# EAGLE design BatteryBalancer (EAGLE 9.1.3)
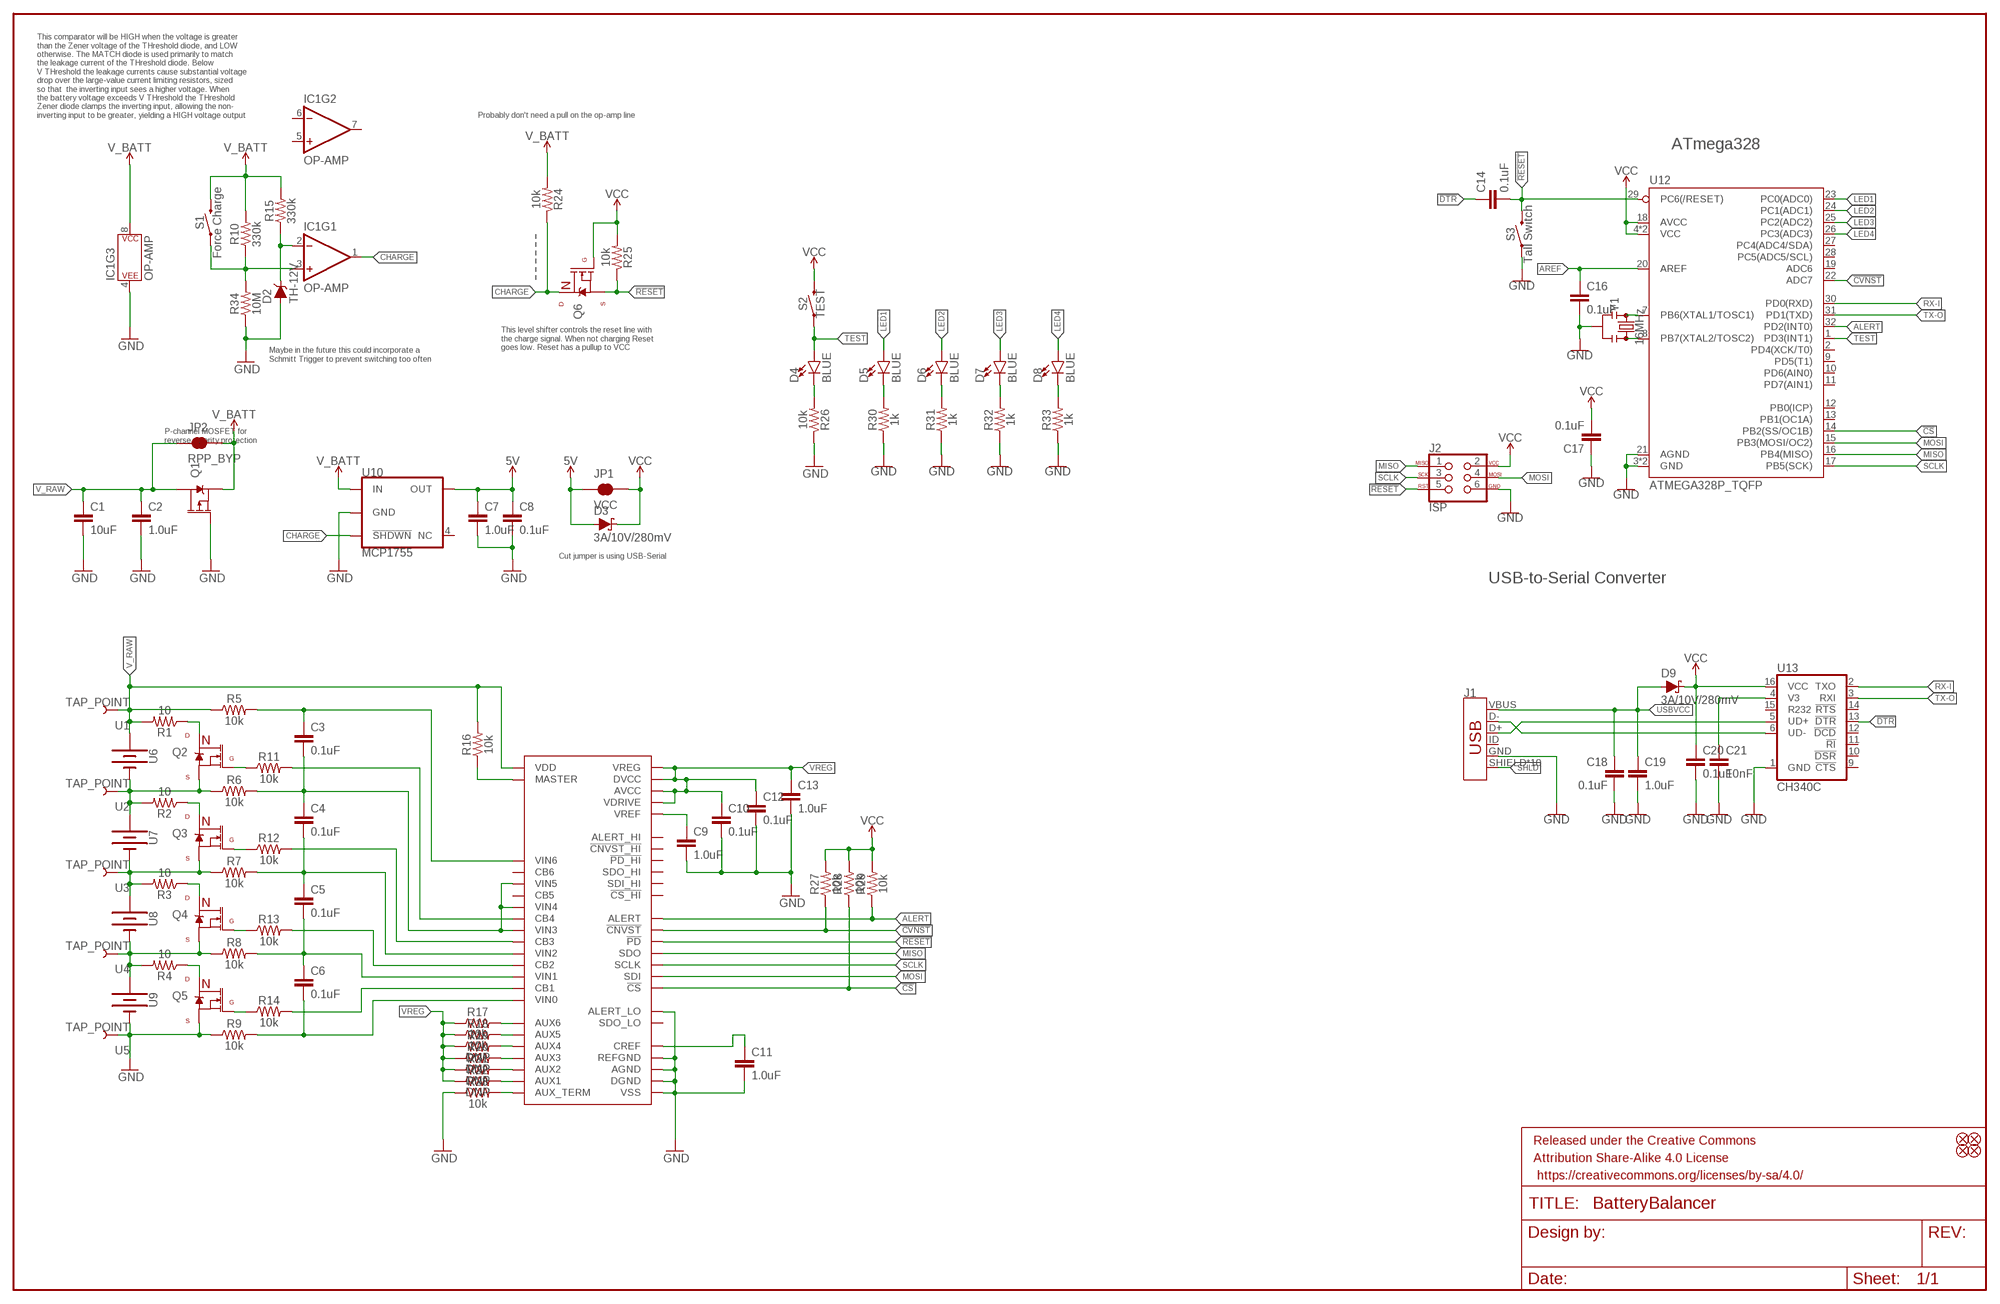
[diagram p0: schematic, sheet 1]

## Parts
C1  10uF  10UF-1210-50V-20%  [1210]
C2  1.0uF  1.0UF-1206-50V-10%  [1206]
C3  0.1uF  0.1UF-0603-25V-5%  [0603]
C4  0.1uF  0.1UF-0603-25V-5%  [0603]
C5  0.1uF  0.1UF-0603-25V-5%  [0603]
C6  0.1uF  0.1UF-0603-25V-5%  [0603]
C7  1.0uF  1.0UF-0603-16V-10%-X7R  [0603]
C8  0.1uF  0.1UF-0603-25V-5%  [0603]
C9  1.0uF  1.0UF-0603-16V-10%-X7R  [0603]
C10  0.1uF  0.1UF-0603-25V-5%  [0603]
C11  1.0uF  1.0UF-0603-16V-10%-X7R  [0603]
C12  0.1uF  0.1UF-0603-25V-5%  [0603]
C13  1.0uF  1.0UF-0603-16V-10%-X7R  [0603]
C14  0.1uF  0.1UF-0603-25V-(+80/-20%)  [0603]
C16  0.1uF  0.1UF-0603-25V-(+80/-20%)  [0603]
C17  0.1uF  0.1UF-0603-25V-(+80/-20%)  [0603]
C18  0.1uF  0.1UF-0603-25V-(+80/-20%)  [0603]
C19  1.0uF  1.0UF-0603-16V-10%-X7R  [0603]
C20  0.1uF  0.1UF-0603-25V-(+80/-20%)  [0603]
C21  10nF  10NF-0603-50V-10%  [0603]
D2  TH-12V  DIODE-ZENER-MMBZ5233BLT1G  [SOT23-3]
D3  3A/10V/280mV  DIODE-SCHOTTKY-BAT60A  [SOD-323]
D4  BLUE  LED-BLUE0603  [LED-0603]
D5  BLUE  LED-BLUE0603  [LED-0603]
D6  BLUE  LED-BLUE0603  [LED-0603]
D7  BLUE  LED-BLUE0603  [LED-0603]
D8  BLUE  LED-BLUE0603  [LED-0603]
D9  3A/10V/280mV  DIODE-SCHOTTKY-BAT60A  [SOD-323]
FD1  FIDUCIALUFIDUCIAL  [FIDUCIAL-MICRO]
FD2  FIDUCIALUFIDUCIAL  [FIDUCIAL-MICRO]
FD3  FIDUCIALUFIDUCIAL  [FIDUCIAL-MICRO]
FD4  FIDUCIALUFIDUCIAL  [FIDUCIAL-MICRO]
FRAME1  FRAME-LEDGER  [CREATIVE_COMMONS]
IC1  OP-AMP  OPAMP-DUALU  [SO08]
J1  USB_MICRO-B_HALF_PTH_MILL  [USB-MICROB-PTH-MILL]
J2  ISP  AVR_SPI_PROG_3X2TESTPOINTS  [2X3_TEST_POINTS]
JP1  VCC  JUMPER-SMT_2_NC_TRACE_SILK  [SMT-JUMPER_2_NC_TRACE_SILK]
JP2  RPP_BYP  JUMPER-SMT_2_NC_TRACE_SILK  [SMT-JUMPER_2_NC_TRACE_SILK]
Q1  MOSFET_PCH-IRLML2244  [SOT23-3]
Q2  AMP_MOSFET_NCH-2N7002K  [SOT23-3]
Q3  AMP_MOSFET_NCH-2N7002K  [SOT23-3]
Q4  AMP_MOSFET_NCH-2N7002K  [SOT23-3]
Q5  AMP_MOSFET_NCH-2N7002K  [SOT23-3]
Q6  AMP_MOSFET_NCH-2N7002K  [SOT23-3]
R1  10  10OHM-1206-1/4W-1%  [1206]
R2  10  10OHM-1206-1/4W-1%  [1206]
R3  10  10OHM-1206-1/4W-1%  [1206]
R4  10  10OHM-1206-1/4W-1%  [1206]
R5  10k  10KOHM-0603-1/10W-1%  [0603]
R6  10k  10KOHM-0603-1/10W-1%  [0603]
R7  10k  10KOHM-0603-1/10W-1%  [0603]
R8  10k  10KOHM-0603-1/10W-1%  [0603]
R9  10k  10KOHM-0603-1/10W-1%  [0603]
R10  330k  330KOHM-0603-1/10W-1%  [0603]
R11  10k  10KOHM-0603-1/10W-1%  [0603]
R12  10k  10KOHM-0603-1/10W-1%  [0603]
R13  10k  10KOHM-0603-1/10W-1%  [0603]
R14  10k  10KOHM-0603-1/10W-1%  [0603]
R15  330k  330KOHM-0603-1/10W-1%  [0603]
R16  10k  10KOHM-0603-1/10W-1%  [0603]
R17  10k  10KOHM-0603-1/10W-1%  [0603]
R18  10k  10KOHM-0603-1/10W-1%  [0603]
R19  DNP  NTC_STOP_ONE_SIDE  [AXIAL-0.3]
R20  DNP  NTC_STOP_ONE_SIDE  [AXIAL-0.3]
R21  DNP  NTC_STOP_ONE_SIDE  [AXIAL-0.3]
R22  DNP  NTC_STOP_ONE_SIDE  [AXIAL-0.3]
R23  10k  10KOHM-0603-1/10W-1%  [0603]
R24  10k  10KOHM-0603-1/10W-1%  [0603]
R25  10k  10KOHM-0603-1/10W-1%  [0603]
R26  10k  10KOHM-0603-1/10W-1%  [0603]
R27  10k  10KOHM-0603-1/10W-1%  [0603]
R28  10k  10KOHM-0603-1/10W-1%  [0603]
R29  10k  10KOHM-0603-1/10W-1%  [0603]
R30  1k  1KOHM-0603-1/10W-1%  [0603]
R31  1k  1KOHM-0603-1/10W-1%  [0603]
R32  1k  1KOHM-0603-1/10W-1%  [0603]
R33  1k  1KOHM-0603-1/10W-1%  [0603]
R34  10M  10MOHM-0603-1/10W-5%  [0603]
S1  Force Charge  MOMENTARY-SWITCH-SPST-SMD-5.2-TALL-REDUNDANT  [TACTILE_SWITCH_SMD_5.2MM]
S2  TEST  MOMENTARY-SWITCH-SPST-SMD-5.2-TALL-REDUNDANT  [TACTILE_SWITCH_SMD_5.2MM]
S3  Tall Switch  MOMENTARY-SWITCH-SPST-SMD-5.2-TALL-REDUNDANT  [TACTILE_SWITCH_SMD_5.2MM]
U1  TAP_POINT  [1X01_SMD_0.1IN]
U2  TAP_POINT  [1X01_SMD_0.1IN]
U3  TAP_POINT  [1X01_SMD_0.1IN]
U4  TAP_POINT  [1X01_SMD_0.1IN]
U5  TAP_POINT  [1X01_SMD_0.1IN]
U6  SINGLECELL  (no package)
U7  SINGLECELL  (no package)
U8  SINGLECELL  (no package)
U9  SINGLECELL  (no package)
U10  MCP1755  [SOT23-5]
U11  AD7280A  [LQFP-48]
U12  ATMEGA328P_TQFP  [TQFP32-08]
U13  CH340C  [SO016]
Y1  16MHz  RESONATOR-16MHZSMD_3.2X1.3  [RESONATOR-SMD-3.2X1.3]

## Nets
5V: C7.1 C8.1 D3.A JP1.1 U10.5(OUT)
!CS: R28.1 U11.21(!CS) U12.14(PB2(SS/OC1B))
!CVNST: R27.1 U11.24(!CNVST) U12.22(ADC7)
!DTR: C14.1 U13.13(!DTR)
!RESET: C14.2 J2.5 Q6.2(S) R25.1 S3.3 S3.4 U11.15(!PD) U12.29(PC6(/RESET))
ALERT: R29.1 U11.27(ALERT) U12.32(PD2(INT0))
AREF: C16.1 U12.20(AREF)
CHARGE: IC1.1(OUT) Q6.3(D) R24.1 U10.3(!SHDWN)
D+: J1.D+ U13.5(UD+)
D-: J1.D- U13.6(UD-)
GND: C1.2 C2.2 C7.2 C8.2 C9.2 C10.2 C11.2 C12.2 C13.2 C16.2 C17.1 C18.2 C19.2 C20.2 C21.2 D2.1(A) IC1.4(P$V-) J1.GND J2.6 Q1.1(G) Q5.2(S) R9.1 R23.1 R26.1 R30.1 R31.1 R32.1 R33.1 R34.1 S3.1 S3.2 U5.1 U9.- U10.2(GND) U11.17(VSS) U11.20(DGND) U11.28(ALERT_LO) U11.31(AGND) U11.41(REFGND) U12.3(GND) U12.5(GND) U12.21(AGND) U13.1(GND) Y1.2
LED1: D5.A U12.23(PC0(ADC0))
LED2: D6.A U12.24(PC1(ADC1))
LED3: D7.A U12.25(PC2(ADC2))
LED4: D8.A U12.26(PC3(ADC3))
MISO: J2.1 U11.26(SDO) U12.16(PB4(MISO))
MOSI: J2.4 U11.23(SDI) U12.15(PB3(MOSI/OC2))
N$3: U12.7(PB6(XTAL1/TOSC1)) Y1.1
N$4: U12.8(PB7(XTAL2/TOSC2)) Y1.3
N$5: Q2.3(D) R1.1
N$6: Q2.2(S) R2.2 R6.1 U2.1 U6.- U7.+
N$7: Q3.3(D) R2.1
N$8: Q3.2(S) R3.2 R7.1 U3.1 U7.- U8.+
N$9: Q4.3(D) R3.1
N$10: Q4.2(S) R4.2 R8.1 U4.1 U8.- U9.+
N$11: Q5.3(D) R4.1
N$12: Q2.1(G) R11.1
N$13: Q3.1(G) R12.1
N$14: R16.1 U11.14(MASTER)
N$15: Q4.1(G) R13.1
N$16: Q5.1(G) R14.1
N$17: C6.2 R9.2 U11.13(VIN0)
N$18: R14.2 U11.12(CB1)
N$19: C5.2 C6.1 R8.2 U11.11(VIN1)
N$20: R13.2 U11.10(CB2)
N$21: C4.2 C5.1 R7.2 U11.9(VIN2)
N$22: R12.2 U11.8(CB3)
N$23: R22.P$2 U11.38(AUX1)
N$24: R11.2 U11.6(CB4)
N$25: C3.1 R5.2 U11.1(VIN6)
N$26: C3.2 C4.1 R6.2 U11.3(VIN5) U11.5(VIN4) U11.7(VIN3)
N$27: C9.1 U11.40(VREF)
N$28: R17.2 U11.33(AUX6)
N$29: C11.1 U11.39(CREF)
N$30: R23.2 U11.32(AUX_TERM)
N$31: R18.2 U11.34(AUX5)
N$32: R21.P$2 U11.37(AUX2)
N$33: R20.P$2 U11.36(AUX3)
N$34: R19.P$2 U11.35(AUX4)
N$37: D4.C R26.2
N$38: C21.1 U13.4(V3)
N$39: D8.C R33.2
N$40: IC1.3(+IN) R10.1 R34.2 S1.1 S1.2
N$41: D2.3(C) IC1.2(-IN) R15.1
N$42: D7.C R32.2
N$43: D6.C R31.2
N$44: D5.C R30.2
RX-I: U12.30(PD0(RXD)) U13.2(TXO)
SCLK: J2.3 U11.22(SCLK) U12.17(PB5(SCK))
SHLD: J1.SHIELD J1.SHIELD2(SHIELD) J1.SHIELD3(SHIELD) J1.SHIELD4(SHIELD) J1.SHIELD5(SHIELD) J1.SHIELD6(SHIELD) J1.SHIELD7(SHIELD) J1.SHIELD8(SHIELD) J1.SHIELD9(SHIELD) J1.SHIELD10(SHIELD)
TEST: D4.A S2.1 S2.2 U12.1(PD3(INT1))
TX-O: U12.31(PD1(TXD)) U13.3(RXI)
USBVCC: C18.1 C19.1 D9.A J1.VBUS
V_BATT: IC1.8(P$V+) JP2.2 Q1.2(S) R10.2 R15.2 R24.2 S1.3 S1.4 U10.1(IN)
V_RAW: C1.1 C2.1 JP2.1 Q1.3(D) R1.2 R5.1 R16.2 U1.1 U6.+ U11.16(VDD)
VCC: C17.2 C20.1 D3.C D9.C J2.2 JP1.2 Q6.1(G) R25.2 R27.2 R28.2 R29.2 S2.3 S2.4 U12.4(VCC) U12.6(VCC) U12.18(AVCC) U13.16(VCC)
VREG: C10.1 C12.1 C13.1 R17.1 R18.1 R19.P$1 R20.P$1 R21.P$1 R22.P$1 U11.18(VREG) U11.19(DVCC) U11.29(VDRIVE) U11.30(AVCC)
Unconnected: IC1.5(+IN) IC1.6(-IN) IC1.7(OUT) J1.ID U10.4(NC) U11.2(CB6) U11.4(CB5) U11.25(SDO_LO) U11.42(ALERT_HI) U11.43(SDI_HI) U11.44(!CNVST_HI) U11.45(SDO_HI) U11.46(!CS_HI) U11.47(!PD_HI) U12.2(PD4(XCK/T0)) U12.9(PD5(T1)) U12.10(PD6(AIN0)) U12.11(PD7(AIN1)) U12.12(PB0(ICP)) U12.13(PB1(OC1A)) U12.19(ADC6) U12.27(PC4(ADC4/SDA)) U12.28(PC5(ADC5/SCL)) U13.9(!CTS) U13.10(!DSR) U13.11(!RI) U13.12(!DCD) U13.14(!RTS) U13.15(R232)

## Notes on the sheet
- This comparator will be HIGH when the voltage is greater
  than the Zener voltage of the THreshold diode, and LOW 
  otherwise. The MATCH diode is used primarily to match
  the leakage current of the THreshold diode. Below 
  V THreshold the leakage currents cause substantial voltage 
  drop over the large-value current limiting resistors, sized 
  so that  the inverting input sees a higher voltage. When 
  the battery voltage exceeds V THreshold the THreshold
  Zener diode clamps the inverting input, allowing the non-
  inverting input to be greater, yielding a HIGH voltage output
- Probably don't need a pull on the op-amp line
- ATmega328
- This level shifter controls the reset line with
  the charge signal. When not charging Reset
  goes low. Reset has a pullup to VCC
- Maybe in the future this could incorporate a 
  Schmitt Trigger to prevent switching too often
- P-channel MOSFET for 
  reverse polarity protection
- Cut jumper is using USB-Serial
- USB-to-Serial Converter

## Library data of the parts
C1 = SparkFun-Capacitors:10UF: 10.0µF ceramic capacitors A capacitor is a passive two-terminal electrical component used to store electrical energy temporarily in an electric field.; PROD_ID: CAP-09824
C2 = SparkFun-Capacitors:1.0UF: 1µF ceramic capacitors A capacitor is a passive two-terminal electrical component used to store electrical energy temporarily in an electric field.; PROD_ID: CAP-09822
C3-C6 C8 C10 C12 = SparkFun-Capacitors:0.1UF: 0.1µF ceramic capacitors A capacitor is a passive two-terminal electrical component used to store electrical energy temporarily in an electric field.; PROD_ID: CAP-08604
C7 C9 C11 C13 C19 = SparkFun-Capacitors:1.0UF: 1µF ceramic capacitors A capacitor is a passive two-terminal electrical component used to store electrical energy temporarily in an electric field.; PROD_ID: CAP-13930
C14 C16-C18 C20 = SparkFun-Capacitors:0.1UF: 0.1µF ceramic capacitors A capacitor is a passive two-terminal electrical component used to store electrical energy temporarily in an electric field.; PROD_ID: CAP-00810
C21 = SparkFun-Capacitors:10NF: 0.01uF/10nF/10,000pF ceramic capacitors A capacitor is a passive two-terminal electrical component used to store electrical energy temporarily in an electric field. CAP-09321; PROD_ID: CAP-00867
D2 = SparkFun-DiscreteSemi:DIODE-ZENER: Zener Diode A Zener diode allows current to flow from its anode to its cathode like a normal semiconductor diode, but it also permits current to flow in the reverse direction when its "Zener voltage" is reached. - WIkipedia; PROD_ID: DIO-14123; VALUE: 6V
D3 D9 = SparkFun-DiscreteSemi:DIODE-SCHOTTKY: Schottky diode A Schottky diode is a semiconductor diode which has a low forward voltage drop and a very fast switching action.; PROD_ID: DIO-14072
D4-D8 = SparkFun-LED:LED-BLUE: Blue SMD LED Used in manufacturing of various products at SparkFun Packages: 0603 - SMD 0603 package [Product Link] <http://www.digikey.com/product-detail/en/SMLE12BC7TT86/511-1589-2-ND/1641808> 1206 - SMD1206 package [Product Link] <http://www.digikey.com/product-detail/en/lite-on-inc/LTST-C150TBKT/160-1643-1-ND/573584> SparkFun Products: ESP8266 Thing-Dev Board <https://www.sparkfun.com/products/13711> RedBoard <https://www.sparkfun.com/products/12757>; PROD_ID: DIO-08575
FD1-FD4 = SparkFun-Aesthetics:FIDUCIAL: Fiducial Alignment Points Point-of-reference for pick-and-place machines and other optical instruments.
FRAME1 = SparkFun-Aesthetics:FRAME-LEDGER: Schematic Frame - Ledger Standard 11x14 US Ledger frame
IC1 = SparkFun-IC-Amplifiers:OPAMP-DUAL: Generic op-amp footprint This component is for the standard 358 pinning of a dual op-amp From the LM358 datasheet: Pin 1: Output A Pin 2: Inverting Input A Pin 3: Non-Inverting Input A Pin 4: Gnd Pin 5: Non-Inverting Input B Pin 6: Inverting Input B Pin 7: Output B Pin 8: V+; PROD_ID: NA-XXXXX
J1 = SparkFun-Connectors:USB_MICRO-B: USB Type Micro-B Connector Male/female and PTH/SMT variants SparkFun Products: SparkFun microB USB Breakout <https://www.sparkfun.com/products/12035> SparkFun USB microB Plug Breakout <https://www.sparkfun.com/products/10031> SparkFun ESP8266 Thing <https://www.sparkfun.com/products/13231>; PROD_ID: CONN-13711
J2 = SparkFun-Connectors:AVR_SPI_PROG_3X2: AVR ISP 6 Pin This is the reduced ISP connector for AVR programming. Common on Arduino. This footprint will take up less PCB space and can be used with a 10-pin to 6-pin adapter such as SKU: BOB-08508 **Special note about "TEST_POINT" package. The stop mask is on the top side, so if you want your programming test points to be on the bottom of your board, make sure to place this package on the bottom side of the board. This also ensure that the orientation to program from the bottom side will be correct. SparkFun Products: SparkFun ISP Pogo Adapter <https://www.sparkfun.com/products/11591> - NS Tiny AVR Programmer <https://www.sparkfun.com/products/11801> -PTH
JP1 JP2 = SparkFun-Jumpers:JUMPER-SMT_2_NC_TRACE: Normally closed trace jumper This jumper has a trace between two pads so it's normally closed (NC). Use a razor knife to open the connection. For best results follow the IPC guidelines for cutting traces: Cutout at least 0.063 mm (0.005 in). Remove all loose material to clean up the cut area. Seal the cut with an approved epoxy. Reapply solder to reclose the connection.
Q1 = SparkFun-DiscreteSemi:MOSFET_PCH: P-channel MOSFETs Voltage controlled devices that allow control of high current outputs. SparkFun Products: SparkFun ESP32 Thing <https://www.sparkfun.com/products/13907> SparkFun ESP8266 Thing <https://www.sparkfun.com/products/13231>; PROD_ID: TRANS-11153; VALUE: 4.3A/20V/54mΩ
Q2-Q6 = MTAES_V2_UniqueParts:AMP_MOSFET_NCH
R1-R4 = SparkFun-Resistors:10OHM: 10Ω resistor A resistor is a passive two-terminal electrical component that implements electrical resistance as a circuit element. Resistors act to reduce current flow, and, at the same time, act to lower voltage levels within circuits. - Wikipedia; PROD_ID: RES-08705
R5-R9 R11-R14 R16-R18 R23-R29 = SparkFun-Resistors:10KOHM: 10kΩ resistor A resistor is a passive two-terminal electrical component that implements electrical resistance as a circuit element. Resistors act to reduce current flow, and, at the same time, act to lower voltage levels within circuits. - Wikipedia; PROD_ID: RES-00824
R10 R15 = SparkFun-Resistors:330KOHM: 330kΩ resistor A resistor is a passive two-terminal electrical component that implements electrical resistance as a circuit element. Resistors act to reduce current flow, and, at the same time, act to lower voltage levels within circuits. - Wikipedia; PROD_ID: RES-08968
R19-R22 = BBLib:NTC_STOP_ONE_SIDE
R30-R33 = SparkFun-Resistors:1KOHM: 1kΩ resistor A resistor is a passive two-terminal electrical component that implements electrical resistance as a circuit element. Resistors act to reduce current flow, and, at the same time, act to lower voltage levels within circuits. - Wikipedia; PROD_ID: RES-07856
R34 = SparkFun-Resistors:10MOHM: RES-09327; PROD_ID: RES-08283
S1-S3 = SparkFun-Switches:MOMENTARY-SWITCH-SPST: Momentary Switch (Pushbutton) - SPST Normally-open (NO) SPST momentary switches (buttons, pushbuttons). Variants PTH-12MM - 12mm square, through-hole Momentary Pushbutton Switch - 12mm Square <https://www.sparkfun.com/products/9190> (COM-09190) PTH-6.0MM, PTH-6.0MM-KIT - 6.0mm square, through-hole Mini Pushbutton Switch <https://www.sparkfun.com/products/97> (COM-00097) KIT package intended for soldering kit's - only one side of pads' copper is exposed. PTH-RIGHT-ANGLE-KIT - Right-angle, through-hole Right Angle Tactile Button <https://www.sparkfun.com/products/10791> - Used on SparkFun BigTime Watch Kit <https://www.sparkfun.com/products/11734> SMD-12MM - 12mm square, surface-mount Tactile Button - SMD (12mm) <https://www.sparkfun.com/products/12993> (COM-12993) Used on SparkFun PicoBoard <https://www.sparkfun.com/products/11888> SMD-4.5MM - 4.5mm Square Trackball Switch Used on SparkFun Blackberry Trackballer Breakout <https://www.sparkfun.com/products/13169> SMD-4.6MMX2.8MM - 4.60mm x 2.80mm, surface mount Used on SparkFun SAMD21 Mini Breakout <https://www.sparkfun.com/products/13664> SMD-5.2MM, SMD-5.2-REDUNDANT - 5.2mm square, surface-mount Mini Pushbutton Switch - SMD <https://www.sparkfun.com/products/8720> (COM-08720) Used on Arduino Pro Mini <https://www.sparkfun.com/products/11114> REDUNDANT package connects both switch circuits together SMD-6.0X3.5MM - 6.0 x 3.5mm, surface mount Momentary Reset Switch SMD <https://www.sparkfun.com/products/8229> (COM-08229) SMD-6.2MM-TALL - 6.2mm square, surface mount Tactile Button - SMD (6mm) <https://www.sparkfun.com/products/12992> Used on SparkFun Digital Sandbox <https://www.sparkfun.com/products/12651> SMD-RIGHT-ANGLE - Right-angle, surface mount Used on SparkFun Block for Intel® Edison - Arduino <https://www.sparkfun.com/products/13036>; PROD_ID: SWCH-14139
U1-U5 = BBLib:TAP_POINT
U6-U9 = BBLib:SINGLECELL
U10 = BBLib:MCP1755
U11 = BBLib:AD7280A
U12 = SparkFun-IC-Microcontroller:ATMEGA328P_TQFP: Popular 328P in QFP Storefront component: ATmega328 - TQFP <https://www.sparkfun.com/products/13448> (COM-13448) Datasheet <http://www.sparkfun.com/datasheets/Components/SMD/ATMega328.pdf> SparkFun Products SparkFun RedBoard - Programmed with Arduino <https://www.sparkfun.com/products/12757> (DEV-12757) Arduino Pro Mini 328 - 5V/16MHz <https://www.sparkfun.com/products/11113> (DEV-11113) Arduino Pro Mini 328 - 3.3V/8MHz <https://www.sparkfun.com/products/11114> (DEV-11114) SparkFun OpenLog <https://www.sparkfun.com/products/13712> (DEV-13712) SparkFun MicroView - OLED Arduino Module <https://www.sparkfun.com/products/12923> (DEV-12923) SparkFun Digital Sandbox <https://www.sparkfun.com/products/12651> (DEV-12651) SparkFun PicoBoard <https://www.sparkfun.com/products/11888> (WIG-11888) Arduino Fio <https://www.sparkfun.com/products/10116> (DEV-10116) LilyPad Arduino 328 Main Board <https://www.sparkfun.com/products/13342> (DEV-13342) SparkFun RedStick <https://www.sparkfun.com/products/13741> (DEV-13741) LilyPad MP3 <https://www.sparkfun.com/products/11013> (DEV-11013) LilyPad Arduino SimpleSnap <https://www.sparkfun.com/products/10941> (DEV-10941) SparkFun Stepoko <https://www.sparkfun.com/products/13899> (ROB-13899) SparkFun Geiger Counter <https://www.sparkfun.com/products/11345> (SEN-11345) SparkFun EL Sequencer <https://www.sparkfun.com/products/12781> (COM-12781) Arduino Pro 328 - 5V/16MHz <https://www.sparkfun.com/products/10915> (DEV-10915) CryptoCape <https://www.sparkfun.com/products/12773> (DEV-12773) SparkFun IR Thermometer Evaluation Board - MLX90614 <https://www.sparkfun.com/products/10740> (SEN-10740) SparkFun RedBot Mainboard <https://www.sparkfun.com/products/12097> (ROB-12097) Arduino Pro 328 - 3.3V/8MHz <https://www.sparkfun.com/products/10914> (DEV-10914) SparkFun Block for Intel® Edison - Arduino <https://www.sparkfun.com/products/13036> (DEV-13036) SparkFun Simon Says - Surface Mount Soldering Kit <https://www.sparkfun.com/products/10935> (KIT-10935) SparkFun 7-Segment Serial Display - Red <https://www.sparkfun.com/products/11441> (COM-11441) SparkFun 7-Segment Serial Display - White <https://www.sparkfun.com/products/11629> (COM-11629) SparkFun 7-Segment Serial Display - Yellow <https://www.sparkfun.com/products/11443> (COM-11443) SparkFun 7-Segment Serial Display - Kelly Green <https://www.sparkfun.com/products/11440> (COM-11440) SparkFun 7-Segment Serial Display - Blue <https://www.sparkfun.com/products/11442> (COM-11442) SparkFun OpenSegment Serial Display - 20mm (Blue) <https://www.sparkfun.com/products/11647> (COM-11647) SparkFun OpenSegment Serial Display - 20mm (Green) <https://www.sparkfun.com/products/11646> (COM-11646) SparkFun OpenSegment Serial Display - 20mm (White) <https://www.sparkfun.com/products/11648> (COM-11648) SparkFun OpenSegment Serial Display - 20mm (Red) <https://www.sparkfun.com/products/11644> (COM-11644) SparkFun OpenSegment Serial Display - 20mm (Yellow) <https://www.sparkfun.com/products/11645> (COM-11645) SparkFun OpenSegment Shield <https://www.sparkfun.com/products/13190> (DEV-13190); PROD_ID: IC-09069
U13 = SparkFun-IC-Comms:CH340C; PROD_ID: IC-14038
Y1 = SparkFun-Clocks:RESONATOR-16MHZ: 16MHz Resonator Digikey Example <http://www.digikey.com/product-detail/en/murata-electronics-north-america/CSTCE16M0V53-R0/490-1198-1-ND/584635> Frequency: 16MHz Frequency Stability: ±0.3% Frequency Tolerance: ±0.5% Capacitance: 15pF SparkFun Products SparkFun OpenLog <https://www.sparkfun.com/products/13712> SparkFun MicroView - OLED Arduino Module <https://www.sparkfun.com/products/12923>; PROD_ID: XTAL-08900

## Board
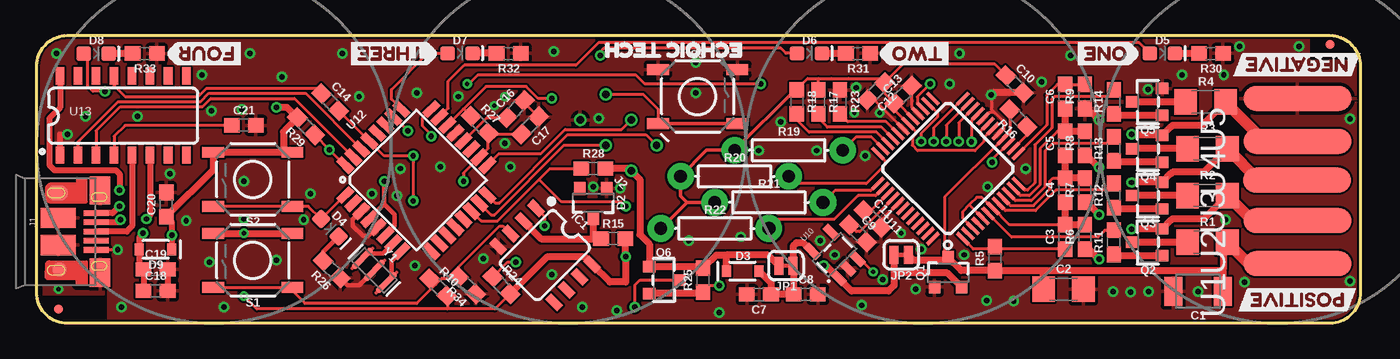
[diagram p1: board, top side]
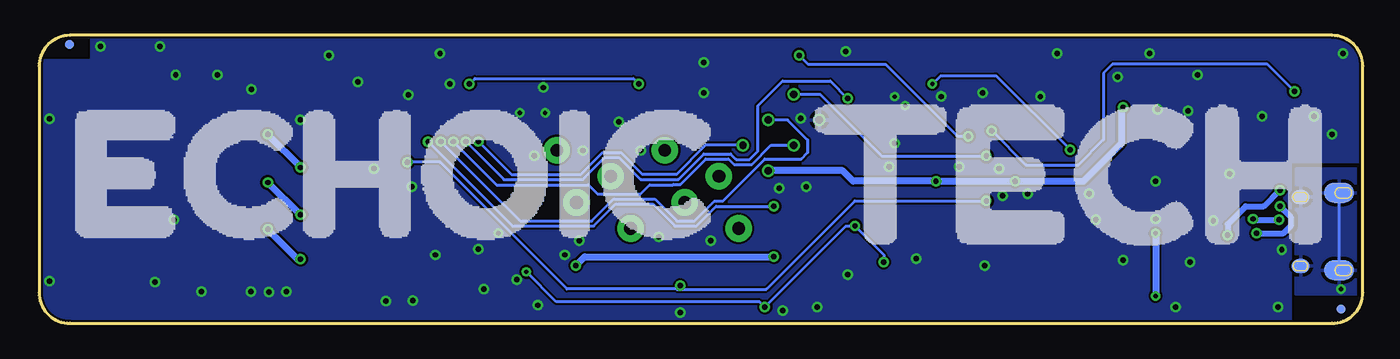
[diagram p2: board, bottom side, seen from below]

Size 93.34 x 20.32 mm. Coordinates in mm from the lower left corner, seen from the top.
Outline: 93.34,18.15 93.34,2.17 arc-90 91.18,0 2.17,0 arc-90 0,2.17 0,18.15 arc-90 2.17,20.32 91.18,20.32 arc-90 93.34,18.15
Copper layers (1*16): Top 0.035mm / dielectric 1.5mm / Bottom 0.035mm
Design rules "SparkFun-2-layer-PCBWay-LIMIT": minimum track width 6mil, minimum drill 0.3mm, track to track 6mil, track to pad 6mil, pad to pad 6mil, via to via 6mil, smd to smd 6mil, copper to edge 6mil, drill to drill 6mil, minimum pad ring 7mil, minimum via ring 7mil, stop-mask expansion 4mil, vias tented up to drill 25mil, thermal gap 10mil

### Footprints (pad centres in the part's own frame; a part is rotated, then mirrored left to right if it is on the bottom)
1210 = smd 1.27 x 2.06: 1 -1.755,0; 2 1.755,0
1206 = smd 1.6 x 1.8: 1 -1.4,0; 2 1.4,0
0603 = smd 1.1 x 1: 1 -0.85,0; 2 0.85,0
SOT23-3 = smd 0.8 x 0.9: 1 -0.95,-1; 2 0.95,-1; 3 0,1.1
SOD-323 = smd 0.63 x 0.83: A 1.15,0; C -1.15,0
LED-0603 = smd 1 x 1: A -0.877,0; C 0.877,0
FIDUCIAL-MICRO = smd 0.635 x 0.635: 1 0,0
SO08 = smd 0.6 x 1.2: 1 -1.905,-2.8; 2 -0.635,-2.8; 3 0.635,-2.8; 4 1.905,-2.8; 5 1.905,2.8; 6 0.635,2.8; 7 -0.635,2.8; 8 -1.905,2.8
USB-MICROB-PTH-MILL = smd 0.4 x 1.75: D+ 0,0; D- -0.65,0; GND 1.3,0; ID 0.65,0; VBUS -1.3,0 | smd 2 x 1.46: SHIELD -2.9,0.275; SHIELD2 2.9,0.275 | smd 1.425 x 2.5: SHIELD3 -0.963,-2.675; SHIELD4 0.963,-2.675 | smd 1.4 x 2.1 bottom: SHIELD5 -2.731,-2.531; SHIELD7 2.729,-2.531 | smd 1 x 1: SHIELD6 2.7,-2.575 | smd 1.1 x 1.5: SHIELD8 -2.731,-2.731 | smd 1 x 1.3 bottom: SHIELD9 -2.43,0.195; SHIELD10 2.43,0.195
2X3_TEST_POINTS = drill 0.508: 1 -2.54,-1.27; 2 -2.54,1.27; 3 0,-1.27; 4 0,1.27; 5 2.54,-1.27; 6 2.54,1.27
SMT-JUMPER_2_NC_TRACE_SILK = smd 0.635 x 1.27: 1 -0.508,0; 2 0.508,0
AXIAL-0.3 = drill 0.9 pad 1.88: P$1 -3.81,0; P$2 3.81,0
TACTILE_SWITCH_SMD_5.2MM = smd 1.524 x 0.762: 1 -2.794,1.905; 2 2.794,1.905; 3 -2.794,-1.905; 4 2.794,-1.905
1X01_SMD_0.1IN = smd 1.778 x 7.62: 1 0,0
SOT23-5 = smd 0.55 x 1.2: 1 -0.95,-1.3; 2 0,-1.3; 3 0.95,-1.3; 4 0.95,1.3; 5 -0.95,1.3
LQFP-48 = smd 0.254 x 1.143: 1 -2.75,-4.25; 2 -2.25,-4.25; 3 -1.75,-4.25; 4 -1.25,-4.25; 5 -0.75,-4.25; 6 -0.25,-4.25; 7 0.25,-4.25; 8 0.75,-4.25; 9 1.25,-4.25; 10 1.75,-4.25; 11 2.25,-4.25; 12 2.75,-4.25; 25 2.75,4.25; 26 2.25,4.25; 27 1.75,4.25; 28 1.25,4.25; 29 0.75,4.25; 30 0.25,4.25; 31 -0.25,4.25; 32 -0.75,4.25; 33 -1.25,4.25; 34 -1.75,4.25; 35 -2.25,4.25; 36 -2.75,4.25 | smd 1.143 x 0.254: 13 4.25,-2.75; 14 4.25,-2.25; 15 4.25,-1.75; 16 4.25,-1.25; 17 4.25,-0.75; 18 4.25,-0.25; 19 4.25,0.25; 20 4.25,0.75; 21 4.25,1.25; 22 4.25,1.75; 23 4.25,2.25; 24 4.25,2.75; 37 -4.25,2.75; 38 -4.25,2.25; 39 -4.25,1.75; 40 -4.25,1.25; 41 -4.25,0.75; 42 -4.25,0.25; 43 -4.25,-0.25; 44 -4.25,-0.75; 45 -4.25,-1.25; 46 -4.25,-1.75; 47 -4.25,-2.25; 48 -4.25,-2.75
TQFP32-08 = smd 1.27 x 0.559: 1 -4.293,2.8; 2 -4.293,2; 3 -4.293,1.2; 4 -4.293,0.4; 5 -4.293,-0.4; 6 -4.293,-1.2; 7 -4.293,-2; 8 -4.293,-2.8; 17 4.293,-2.8; 18 4.293,-2; 19 4.293,-1.2; 20 4.293,-0.4; 21 4.293,0.4; 22 4.293,1.2; 23 4.293,2; 24 4.293,2.8 | smd 0.559 x 1.27: 9 -2.8,-4.293; 10 -2,-4.293; 11 -1.2,-4.293; 12 -0.4,-4.293; 13 0.4,-4.293; 14 1.2,-4.293; 15 2,-4.293; 16 2.8,-4.293; 25 2.8,4.293; 26 2,4.293; 27 1.2,4.293; 28 0.4,4.293; 29 -0.4,4.293; 30 -1.2,4.293; 31 -2,4.293; 32 -2.8,4.293
SO016 = smd 0.6 x 1.2: 1 -4.445,-2.8; 2 -3.175,-2.8; 3 -1.905,-2.8; 4 -0.635,-2.8; 5 0.635,-2.8; 6 1.905,-2.8; 7 3.175,-2.8; 8 4.445,-2.8; 9 4.445,2.8; 10 3.175,2.8; 11 1.905,2.8; 12 0.635,2.8; 13 -0.635,2.8; 14 -1.905,2.8; 15 -3.175,2.8; 16 -4.445,2.8
RESONATOR-SMD-3.2X1.3 = smd 0.45 x 1.905: 1 -1.2,0; 2 0,0; 3 1.2,0

### Placement (x,y rotation side)
C1  81.89,2.26 180 top
C2  72.4,2.4 0 top
C3  72.52,6.1 90 top
C4  72.52,9.4 90 top
C5  72.52,12.7 90 top
C6  72.52,16 90 top
C7  50.93,2.03 180 top
C8  54.23,2.03 0 top
C9  57.91,6.35 315 top
C10  68.96,16.89 315 top
C11  58.93,7.37 315 top
C12  59.18,16.38 225 top
C13  61.09,16.13 45 top
C14  20.7,15.62 315 top
C16  33.78,15.11 45 top
C17  34.8,13.97 225 top
C18  8.38,2.29 0 top
C19  8.38,3.81 0 top
C20  9.14,8.38 90 top
C21  14.61,13.97 0 top
D2  39.24,8.51 180 top
D3  49.78,3.68 0 top
D4  20.66,6.74 315 top
D5  79.38,19.05 0 top
D6  54.48,19.05 0 top
D7  29.84,19.05 0 top
D8  4.19,19.05 0 top
D9  8.38,5.21 180 top
FD1  91.19,19.68 0 top
FD2  91.19,19.68 0 bottom
FD3  1.52,1.02 0 top
FD4  1.52,1.02 0 bottom
FRAME1  11.44,-12.11 0 top  (outside the outline)
IC1  35.85,4.79 225 top
J1  4.19,6.48 270 top
J2  41.02,13.46 135 top
JP1  52.83,4.06 180 top
JP2  60.96,4.83 180 top
Q1  64.26,3.56 0 top
Q2  78.36,5.71 90 top
Q3  78.36,9.02 90 top
Q4  78.36,12.32 90 top
Q5  78.36,15.62 90 top
Q6  44.2,3.05 270 top
R1  82.55,5.71 0 top
R2  82.55,9.02 0 top
R3  82.55,12.32 0 top
R4  82.42,15.62 0 top
R5  67.56,4.57 90 top
R6  73.91,6.1 90 top
R7  73.91,9.4 90 top
R8  73.91,12.7 90 top
R9  73.91,16 90 top
R10  28.32,2.54 315 top
R11  75.95,5.71 90 top
R12  75.95,9.02 90 top
R13  75.95,12.32 90 top
R14  75.95,15.62 90 top
R15  40.64,5.97 0 top
R16  69.22,14.48 135 top
R17  55.12,15.62 270 top
R18  53.59,15.62 270 top
R19  53.02,12.21 0 top
R20  49.22,10.37 0 top
R21  51.63,8.53 0 top
R22  47.82,6.69 0 top
R23  56.64,15.62 270 top
R24  32.77,2.67 315 top
R25  46.99,3.05 90 top
R26  20.8,3.8 135 top
R27  31.24,14.03 315 top
R28  39.24,10.92 0 top
R29  18.98,13.91 135 top
R30  82.8,19.05 180 top
R31  57.91,19.05 180 top
R32  33.27,19.05 180 top
R33  7.62,19.05 180 top
R34  30.35,2.67 135 top
S1  15.24,4.45 180 top
S2  15.24,10.16 180 top
S3  46.61,16.01 0 top
U1  88.9,4.21 90 top
U2  88.9,7.25 90 top
U3  88.87,10.11 90 top
U4  88.9,12.84 90 top
U5  88.9,15.88 90 top
U10  56.26,4.83 45 top
U11  64.26,10.92 45 top
U12  26.77,10.11 45 top
U13  6.1,14.66 0 top
U$1  [POSITIVE1]  93.15,1.66 180 top
U$2  [NEGATIVE0]  93.4,18.26 180 top
U$3  [ONE3]  77.78,19.03 180 top
U$4  [TWO4]  64.78,19.03 180 top
U$5  [THREE6]  28.27,19.03 180 top
U$6  [FOUR5]  14.9,19.03 180 top
U$7  [ECHOIC_TECH7]  50.65,19.28 180 top
U$8  [ECHOIC#JPG]  68.58,10.16 0 bottom
U$9  [TECH#JPG]  20.32,10.16 0 bottom
Y1  23.81,3.73 315 top

### Tracks (layer width: path | path; a pad name or v marks a point on that pad's centre or on a via)
5V
  Top 0.508: U10.5 54.06,5.68 53.56,5.68 53.34,5.46 JP1.1 53.38,4.03 C8.1 C7.1 51.78,2.84 D3.A
!CS  (via drill 0.38)
  Top 0.203: U11.21 65.91,14.34 v65.91,12.81 | U12.14 31.34,7.24 32.51,7.24 35.43,10.16 | v41.53,8.26 41.21,8.57 37.02,8.57 35.43,10.16 | R28.1 36.19,10.92 35.43,10.16
  Bottom 0.203: v65.91,12.81 59.96,6.86 54.23,6.86 52.68,8.41 50.06,8.41 48.51,6.86 46.99,6.86 45.59,8.26 v41.53,8.26
!CVNST  (via drill 0.38)
  Top 0.203: U11.24 63.25,13.79 v63.25,12.83 | U12.22 30.09,15.12 | R27.1 30.15,15.12 30.09,15.12 | v36.32,15.88 35.36,15.88 34.52,16.71 31.68,16.71 30.09,15.12
  Bottom 0.203: v63.25,12.83 60.55,10.13 55.02,10.13 53.47,11.68 52.45,11.68 50.93,10.16 48.26,10.16 46.47,11.95 44.58,11.95 44.2,11.57 43.23,11.57 42.67,12.13 42.67,15.34 40.91,17.1 37.54,17.1 v36.32,15.88
!DTR
  Top 0.203: U13.13 5.46,16.76 6.22,16 11.4,16 11.98,16.59 19.74,16.59 C14.1
!RESET  (via drill 0.38)
  Top 0.203: U11.15 67.36,11.55 v67.36,11.38 | v48.13,2.65 47.45,2.65 R25.1 | J2.5 42.77,16.16 43.81,15.12 S3.3 | 23.49,12.82 24.5,11.81 v26.54,11.81 v26.54,8.64 | 23.49,12.82 U12.29 | C14.2 23.49,12.83 23.49,12.82
  Top 0.254: S3.4 S3.3
  Top 0.508: R25.1 46.89,2.1 Q6.2
  Bottom 0.203: v26.54,11.81 33.91,11.81 38.25,16.16 J2.5 | v26.54,8.64 35.81,8.64 42.05,2.4 48.13,2.4 | 48.13,2.4 48.39,2.4 48.36,2.43 56.13,2.43 65.08,11.38 v67.36,11.38 | v48.13,2.65 48.13,2.4
ALERT  (via drill 0.3, 0.38)
  Top 0.203: U11.27 62.1,15.56 62.1,16 v62.99,16.89 | R29.1 v20.64,12.25 21.73,11.16 U12.32 | v30.35,16.89 30.47,16.89 31.08,17.5 42.27,17.5 42.88,16.89 v51.05,16.89
  Bottom 0.203: v62.99,16.89 62.61,17.27 51.44,17.27 v51.05,16.89 | v20.64,12.25 25.84,17.46 29.78,17.46 v30.35,16.89
AREF
  Top 0.203: U12.20 31.74,14.51 C16.1
CHARGE  (via drill 0.3, 0.38)
  Top 0.203: R24.1 33.22,4.32 v33.78,4.32 | v42.16,1.14 42.16,2.67 42.55,3.05 Q6.3 | IC1.1 35.81,7.53 v35.81,6.87 | v58.98,3.63 58.03,4.58 U10.3
  Bottom 0.203: v33.78,4.32 33.78,4.84 v35.81,6.87 36.45,6.87 42.16,1.15 v42.16,1.14 42.55,1.52 56.87,1.52 v58.98,3.63
D+
  Top 0.406: J1.D+ 6.35,6.48 6.73,6.86 U13.5
D-  (via drill 0.38)
  Top 0.406: J1.D- 5.72,7.13 v5.9,7.31 | v7.75,7.37 8,7.62 U13.6
  Bottom 0.406: v5.9,7.31 7.69,7.31 v7.75,7.37
GND  (via drill 0.3, 0.38)
  Top 0.203: U11.20 67.14,14.86 67.56,14.86 | U11.17 68.2,13.8 68.2,14.22 67.56,14.86 | U11.41 59.53,7.25 C11.2 | U11.28 61.69,15.26 C13.2 | C12.2 59.05,15.78 U11.31 | 67.56,14.86 67.31,15.11 v67.31,16.13 | J1.GND 5.68,5.18 v5.71,5.21 | C17.1 34.38,15.59 C16.2
  Top 0.305: U12.3 22.28,7.31 22.28,6.88 23,6.16 23.39,6.16 U12.5 | Y1.2 22.74,2.67 21.93,2.67 R26.1
  Top 0.406: C19.2 C18.2 | U13.1 1.65,13.34 v2.16,13.34
  Top 0.508: R9.1 74.21,14.86 74.4,14.86 v74.91,14.35 | C10.2 67.47,16.29 v67.31,16.13
  other vias: 78.36,16.51 64.39,16.89 69.72,10.92 56.26,4.83 55.24,5.84 15.03,19.05 36.45,19.18 65.07,19.05 84.83,19.55 52.45,14.22 58.42,11.81 75.9,2.24 77.14,2.21 78.41,2.24 5.97,1.14 3.43,14.61 14.48,15.11 9.4,10.54 39.24,9.65 41.15,9.53 10.54,7.24 14.61,7.37 18.82,7.32 31.5,4.57 57.66,14.86 59.44,14.86 60.96,6.35 32.26,15.37 33.02,16 12.19,4.32 16.89,4.45 14.61,10.03 12.32,14.99 7.11,14.61 21.55,19.05 22.73,16 29.72,16 26.8,16.26 28.45,11.05 25.65,10.92 19.3,9.14 25.4,9.02 23.62,9.14 13.21,1.14 36.32,3.43 45.97,5.84 49.66,6.1 50.93,12.19 54.99,12.19 40.89,0.89 38.48,1.14 48.13,0.76 58.17,1.27 61.98,2.41 66.98,1.6 65.41,4.83 67.06,9.65 80.77,17.53 83.71,17.52 92.61,14.43 1.4,19.05 70.86,17.04 68.88,1.57 89.02,19.55 92.61,2.97 81.9,2.25 85.17,2.9 83.83,7.31 57.78,16.64 59.66,3.07 62.36,5.23 26.67,4.06 33.4,11.05 39.62,14.48 33.02,12.7 46.48,16.26 46.48,18.41 11.65,17.53 17.27,17.41 72.9,18.91
  pour Top (isolate 0.152, rank 2): 5.08,0 5.08,12.7 0,12.7 0,20.32 89.66,20.33 89.66,18.54 93.34,18.54 93.34,0
  pour Bottom (isolate 0.152, rank 2): 5.08,0 5.08,11.43 0,11.43 0,20.32 89.66,20.32 89.66,18.54 93.34,18.54 93.34,0
LED1
  Top 0.203: D5.A 77.74,19.8 39.62,19.8 38.02,18.21 30.15,18.21 29.02,17.08 29.02,15.18 U12.23
LED2  (via drill 0.38)
  Top 0.203: D6.A 52.83,19.05 52.43,19.45 40.01,19.45 39.74,19.19 v39.74,18.92 | U12.24 27.18,14.47 27.18,13.97 27.81,13.34 v27.81,13.21
  Bottom 0.203: v27.81,13.21 28.57,13.21 33.65,18.28 39.11,18.28 v39.74,18.92
LED3
  Top 0.203: U12.25 25.02,15.82 25.02,16.51 27.56,19.05 D7.A
LED4  (via drill 0.38)
  Top 0.203: v26.16,13.59 25.19,14.56 U12.26 | v4.83,16.38 3.95,16.38 3.57,16.76 3.57,18.79 D8.A
  Bottom 0.203: v26.16,13.59 23.75,11.18 20.07,11.18 18.29,12.95 18.29,17.65 17.65,18.29 6.73,18.29 v4.83,16.38
MISO  (via drill 0.38)
  Top 0.203: U11.26 63.5,14.87 63.5,14.55 62.36,13.41 v62.36,12.83 | U12.16 32.33,8.51 32.62,8.51 37.43,13.32 42.96,13.32 J2.1
  Bottom 0.203: v62.36,12.83 60.02,10.49 55.16,10.49 53.61,12.04 52.3,12.04 50.78,10.52 48.41,10.52 46.36,12.56 J2.1
MOSI  (via drill 0.38)
  Top 0.203: v64.14,12.83 64.14,13.98 U11.23 | J2.4 37.18,12.56 32.28,7.66 32.05,7.66 U12.15
  Bottom 0.203: v64.14,12.83 61.09,9.78 54.61,9.78 53.98,9.14 50.93,9.14 50.29,9.78 48.64,9.78 48.62,9.8 48.11,9.8 46.32,11.6 44.73,11.6 44.34,11.21 43.07,11.21 41.72,12.56 J2.4
N$3
  Top 0.305: Y1.1 23.32,4.94 24.43,4.94 U12.7
N$4
  Top 0.305: Y1.3 25.02,3.24 25.02,4.39 U12.8
N$5
  Top 0.508: R1.1 Q2.3
N$6  (via drill 0.38)
  Top 0.508: R2.2 82.3,7.37 80.08,7.37 79.98,7.26 79.95,7.26 Q2.2 77.25,6.67 v77.22,6.64 | v74.91,4.52 74.18,5.25 R6.1
  Top 0.762: R2.2 85.71,7.25 U2.1
  Bottom 0.508: v77.22,6.64 75.1,4.52 v74.91,4.52
N$7
  Top 0.508: R2.1 Q3.3
N$8  (via drill 0.38)
  Top 0.508: R3.2 82.3,10.67 80.08,10.67 79.98,10.56 79.95,10.56 Q3.2 77.25,9.97 v77.22,9.94 | R7.1 74.03,8.55 v74.91,7.67
  Top 0.762: R3.2 86.16,10.11 U3.1
  Bottom 0.508: v77.22,9.94 74.95,7.67 v74.91,7.67
N$9
  Top 0.508: R3.1 Q4.3
N$10  (via drill 0.38)
  Top 0.508: R4.2 82.17,13.97 80.08,13.97 79.98,13.87 79.95,13.87 Q4.2 77.28,13.27 v77.22,13.34 | R8.1 74.05,11.85 v74.91,11
  Top 0.762: R4.2 86.61,12.84 U4.1
  Bottom 0.508: v77.22,13.34 74.91,11.02 v74.91,11
N$11
  Top 0.508: R4.1 Q5.3
N$12
  Top 0.508: Q2.1 76.05,4.76 R11.1
N$13
  Top 0.508: Q3.1 76.05,8.07 R12.1
N$14
  Top 0.203: R16.1 69.82,13.29 U11.14
N$15
  Top 0.508: Q4.1 76.05,11.37 R13.1
N$16
  Top 0.508: Q5.1 76.05,14.67 R14.1
N$17
  Top 0.203: U11.13 71.22,13.99 71.22,16.1 71.97,16.85 C6.2 R9.2
N$18
  Top 0.203: R14.2 75.48,16 71.78,16 71.58,15.8 71.58,13.79 70.38,12.59 70.38,9.92 69.86,9.4 69.67,9.4 U11.12
N$19
  Top 0.203: C5.2 71.97,13.55 70.74,12.32 70.74,9.77 69.99,9.02 69.35,9.02 U11.11
  Top 0.508: C6.1 C5.2 R8.2
N$20
  Top 0.203: R13.2 75.48,12.7 71.63,12.7 71.09,12.17 71.09,9.62 70.13,8.66 69,8.66 U11.10
N$21
  Top 0.203: U11.9 68.65,8.31 70.28,8.31 71.45,9.47 71.45,10.03 71.67,10.25 C4.2
  Top 0.508: C5.1 C4.2 R7.2
N$22
  Top 0.203: R12.2 75.48,9.4 71.88,9.4 70.43,7.95 68.29,7.95 U11.8
N$23
  Top 0.203: U11.38 59.17,9.02 57.91,9.02 56.23,7.34 52.27,7.34 R22.P$2
N$24
  Top 0.203: R11.2 75.31,6.57 74.84,6.1 68.73,6.1 U11.6
N$25
  Top 0.203: C3.1 67.56,5.25 | 67.56,5.25 66.05,5.25 U11.1 | R5.2 67.56,5.25
N$26
  Top 0.203: C3.2 68.59,6.95 U11.7 66.65,8.89 66.29,8.89 65.79,8.38 | U11.3 65.28,7.43 65.28,7.87 65.79,8.38 | U11.5 65.79,8.34 65.79,8.38
  Top 0.508: C4.1 C3.2 R6.2
N$27
  Top 0.203: C9.1 57.78,6.48 58.04,6.48 U11.40
N$28
  Top 0.203: U11.33 59.57,13.84 55.75,13.84 55.12,14.48 R17.2
N$29
  Top 0.203: C11.1 58.83,7.97 U11.39
N$30
  Top 0.203: U11.32 59.9,14.22 57.19,14.22 R23.2
N$31
  Top 0.203: U11.34 59.22,13.49 54.46,13.49 53.59,14.35 R18.2
N$32
  Top 0.203: U11.37 58.82,9.37 56.28,9.37 R21.P$2
N$33
  Top 0.203: U11.36 59.82,11.48 59.82,11.18 58.51,9.87 53.53,9.87 R20.P$2
N$34
  Top 0.203: R19.P$2 57.75,13.13 58.87,13.13 U11.35
N$37
  Top 0.305: D4.C 20.2,5.04 R26.2
N$38
  Top 0.203: U13.4 5.46,13.21 6.22,13.97 C21.1
N$39
  Top 0.508: R33.2 D8.C
N$40
  Top 0.203: IC1.3 32.88,6.86 32.64,6.86 29.4,3.62 | 28.13,2.73 28.57,3.17 28.96,3.17 29.4,3.62 | 28.13,2.73 26.8,1.4 18.92,1.4 18.03,2.29 S1.1 S1.2 | R34.2 29.4,3.62 | R10.1 28.13,2.73
N$41
  Top 0.508: 39.24,5.97 35.57,5.97 IC1.2 | 39.24,5.97 R15.1 | D2.3 39.24,5.97
N$42
  Top 0.508: R32.2 D7.C
N$43
  Top 0.508: D6.C R31.2
N$44
  Top 0.508: D5.C R30.2
RX-I
  Top 0.203: U13.2 2.92,12.83 5.74,15.65 11.54,15.65 12.13,16.23 18.95,16.23 U12.30
SCLK  (via drill 0.38)
  Top 0.203: U11.22 65.02,14.16 v65.02,12.83 | U12.17 32.6,11.98 35.56,11.98 37.26,13.67 41.23,13.67 J2.3
  Bottom 0.203: v65.02,12.83 59.41,7.21 54.38,7.21 52.83,8.76 49.92,8.76 48.37,7.21 47.14,7.21 45.74,8.61 45.17,8.61 42.17,11.61 39.59,11.61 39.16,12.04 39.16,12.95 40.57,14.36 J2.3
SHLD  (via drill 0.3)
  Bottom 0.203: J1.SHIELD7 J1.SHIELD5
  other vias: 1.52,2.41
  pour Top (isolate 0.305): 0,10.92 4.7,10.92 4.7,2.03 0,2.03
  pour Bottom (isolate 0.305): 0,2.03 4.7,2.03 4.7,10.92 0,10.92
TEST
  Top 0.203: U12.1 20.07,7.36 | D4.A 19.15,8.26 S2.1 S2.2
  Top 0.305: 20.07,7.36 D4.A
TX-O
  Top 0.203: U13.3 4.19,13.59 5.89,15.29 11.69,15.29 12.28,15.88 18.18,15.88 U12.31
USBVCC  (via drill 0.38)
  Top 0.406: C18.1 C19.1 7.23,4.11 D9.A 7.23,6.09 v7.49,6.35 | J1.VBUS 5.35,7.78 5.83,8.26 v5.84,8.26
  Bottom 0.406: v5.84,8.26 5.62,8.03 5.6,8.03 5.08,7.51 5.08,6.86 5.59,6.35 v7.49,6.35
V_BATT  (via drill 0.3, 0.38)
  Top 0.203: v14.61,1.93 15.52,1.02 28.96,1.02 | R24.2 32.32,1.02 28.96,1.02 | R10.2 28.96,1.91 28.96,1.02
  Top 0.508: Q1.2 64.21,3.56 60.45,3.56 | JP2.2 60.45,3.56 | v55.5,4.06 55.68,4.06 U10.1 57.46,2.29 60.07,2.29 60.45,2.67 60.45,3.56 | R24.2 35.98,4.67 38.66,4.67 IC1.8 40.41,2.92 41.53,2.92 v41.53,4.7 41.49,4.74 R15.2 | S1.3 v14.61,6.35 S1.4
  Bottom 0.508: v41.53,4.7 54.86,4.7 v55.5,4.06 | v14.61,6.35 v14.61,1.93
V_RAW
  Top 0.203: Q1.3 64.01,4.91 64.01,8.9 U11.16 68.61,13.51 R16.2
  Top 0.508: R1.2 83.67,5.43 83.67,3.81 83.64,3.79 | 83.64,3.79 C1.1 | JP2.1 61.85,4.45 64.05,4.45 Q1.3 65.2,3.72 R5.1 71.12,3.72 | 71.12,3.72 83.58,3.72 83.64,3.79 | C2.1 71,3.6 71.12,3.72
  Top 0.762: R1.2 85.45,4.21 U1.1
VCC  (via drill 0.38)
  Top 0.203: S2.3 17.53,12.06 17.4,12.19 | v30.1,10.03 30.1,10.61 U12.18 31.84,12.35 R27.2 31.91,13.37 C17.2
  Top 0.305: U12.6 25.25,6.88 25.25,7.68 24.51,8.41 | U12.4 24.51,8.41 | 24.51,8.41 v24.51,10.03
  Top 0.406: U13.16 1.65,15.24 0.89,14.48 0.89,11.18 1.27,10.79 5.59,10.79 5.84,10.54 v5.84,9.4 | D9.C v9.53,6.22 9.53,7.14 C20.1
  Top 0.508: D3.C 48.63,4.83 | 48.63,4.83 47.92,4.83 R25.2 46.89,4 Q6.1 43.2,5.6 42.53,6.26 42.53,10.15 J2.2 41.77,10.92 R28.2 | 17.4,12.19 17.4,13.51 17.54,13.65 17.54,13.66 R29.2 17.65,15.24 v16.89,15.24 | S2.3 S2.4 12.45,10.83 C20.1 | JP1.2 51.56,4.83 48.63,4.83
  Bottom 0.406: v5.84,9.4 6.99,8.26 8.26,8.26 9.53,6.98 v9.53,6.22
  Bottom 0.508: v16.89,15.24 17.02,15.11 17.02,12.7 19.68,10.03 v24.51,10.03 v30.1,10.03 35.94,10.03 36.68,10.77 J2.2
VREG
  Top 0.203: 60.58,15.53 60.72,15.53 U11.29 | 60.58,15.53 60.58,14.96 U11.30 61.98,13.56 61.98,13.33 61.73,13.09 61.73,12.57 62.11,12.19 66.17,12.19 66.79,12.81 66.79,13.1 | 60.58,15.53 C13.1 59.78,16.23 C12.1 | R18.1 53.59,16.51 54.36,17.27 55.12,17.27 | R17.1 55.12,17.27 | U11.18 66.79,13.1 | 66.79,13.1 66.55,13.34 66.55,13.56 U11.19 | C12.1 61.09,18.29 67.56,18.29 C10.1 | 55.12,17.27 56.03,17.27 56.04,17.27 57.25,17.27 59.49,17.27 C12.1
  Top 0.254: R22.P$1 45.85,8.53 | 45.85,8.53 R21.P$1 | 45.85,8.53 45.41,8.98 R20.P$1 47.25,12.21 R19.P$1 53.47,16.47 R18.1

### Text on the board
tDocu: Owen Lyke